# Altium schematic sheet Sheet1.SchDoc
size A4
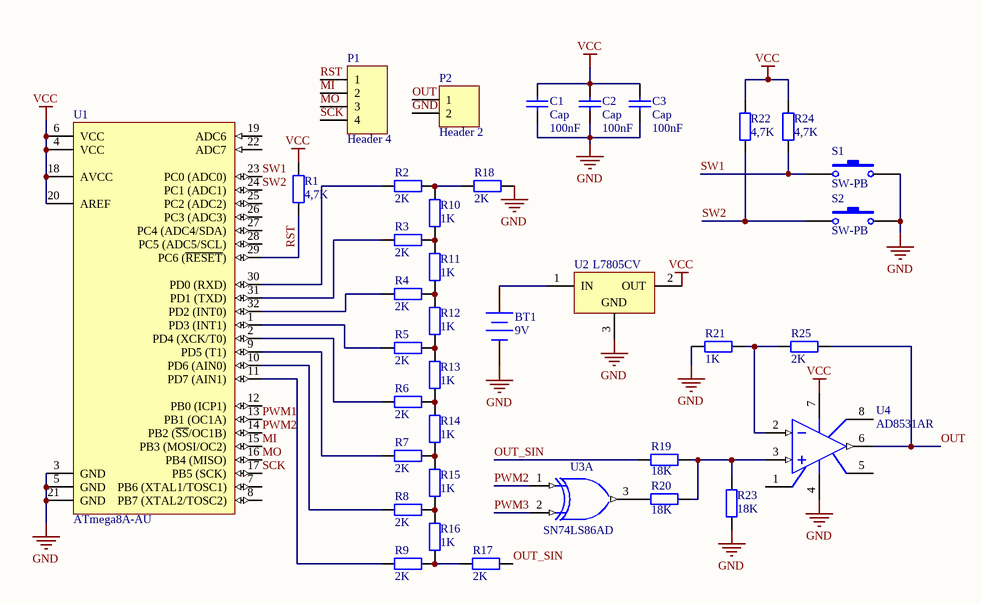
[diagram p0: Sheet1.SchDoc]

## Parts
BT1  9V  [BAT-2]
C1  Cap  value 100nF  [RAD-0.3]
C2  Cap  value 100nF  [RAD-0.3]
C3  Cap  value 100nF  [RAD-0.3]
P1  Header 4  [HDR1X4]
P2  Header 2  [HDR1X2]
R1  value 4,7K  [AXIAL-0.4]  (hidden comment: Res2)
R2  value 2K  [AXIAL-0.4]  (hidden comment: Res2)
R3  value 2K  [AXIAL-0.4]  (hidden comment: Res2)
R4  value 2K  [AXIAL-0.4]  (hidden comment: Res2)
R5  value 2K  [AXIAL-0.4]  (hidden comment: Res2)
R6  value 2K  [AXIAL-0.4]  (hidden comment: Res2)
R7  value 2K  [AXIAL-0.4]  (hidden comment: Res2)
R8  value 2K  [AXIAL-0.4]  (hidden comment: Res2)
R9  value 2K  [AXIAL-0.4]  (hidden comment: Res2)
R10  value 1K  [AXIAL-0.4]  (hidden comment: Res2)
R11  value 1K  [AXIAL-0.4]  (hidden comment: Res2)
R12  value 1K  [AXIAL-0.4]  (hidden comment: Res2)
R13  value 1K  [AXIAL-0.4]  (hidden comment: Res2)
R14  value 1K  [AXIAL-0.4]  (hidden comment: Res2)
R15  value 1K  [AXIAL-0.4]  (hidden comment: Res2)
R16  value 1K  [AXIAL-0.4]  (hidden comment: Res2)
R17  value 2K  [AXIAL-0.4]  (hidden comment: Res2)
R18  value 2K  [AXIAL-0.4]  (hidden comment: Res2)
R19  value 18K  [AXIAL-0.4]  (hidden comment: Res2)
R20  value 18K  [AXIAL-0.4]  (hidden comment: Res2)
R21  value 1K  [AXIAL-0.4]  (hidden comment: Res2)
R22  value 4,7K  [AXIAL-0.4]  (hidden comment: Res2)
R23  value 18K  [AXIAL-0.4]  (hidden comment: Res2)
R24  value 4,7K  [AXIAL-0.4]  (hidden comment: Res2)
R25  value 2K  [AXIAL-0.4]  (hidden comment: Res2)
S1  SW-PB  [SPST-2]
S2  SW-PB  [SPST-2]
U1  ATmega8A-AU  [32A_N]
U2  L7805CV  [TO220ABN]
U3  SN74LS86AD  [D014_N]  (part A of 4)
U4  AD8531AR  [SO-8_N]

## Nets
GND: BT1.2(-) C1.1 C2.1 C3.1 P2.2 R18.2 R21.1 R23.2 S1.2 S2.2 U1.3(GND) U1.5(GND) U1.21(GND) U2.3(GND) U3.7(GND) U4.4(V-)
VCC: C1.2 C2.2 C3.2 R1.2 R22.2 R24.2 U1.4(VCC) U1.6(VCC) U1.18(AVCC) U1.20(AREF) U2.2(OUT) U3.14(VCC) U4.7(V+)
MI: P1.2 U1.15(PB3_(MOSI/OC2))
MO: P1.3 U1.16(PB4_(MISO))
OUT: P2.1 R25.2 U4.6(OUT)
OUT_SIN: R17.2 R19.1
PWM1: U1.13(PB1_(OC1A))
PWM2: U1.14(PB2_(~{SS}/OC1B)) U3.1(A)
PWM3: U3.2(B)
RST: P1.1 R1.1 U1.29(PC6_(~{RESET}))
SCK: P1.4 U1.17(PB5_(SCK))
SW1: R24.1 S1.1 U1.23(PC0_(ADC0))
SW2: R22.1 S2.1 U1.24(PC1_(ADC1))
NetBT1_1: BT1.1(+) U2.1(IN)
NetR2_1: R2.1 U1.30(PD0_(RXD))
NetR2_2: R2.2 R10.2 R18.1
NetR3_1: R3.1 U1.31(PD1_(TXD))
NetR3_2: R3.2 R10.1 R11.2
NetR4_1: R4.1 U1.32(PD2_(INT0))
NetR4_2: R4.2 R11.1 R12.2
NetR5_1: R5.1 U1.1(PD3_(INT1))
NetR5_2: R5.2 R12.1 R13.2
NetR6_1: R6.1 U1.2(PD4_(XCK/T0))
NetR6_2: R6.2 R13.1 R14.2
NetR7_1: R7.1 U1.9(PD5_(T1))
NetR7_2: R7.2 R14.1 R15.2
NetR8_1: R8.1 U1.10(PD6_(AIN0))
NetR8_2: R8.2 R15.1 R16.2
NetR9_1: R9.1 U1.11(PD7_(AIN1))
NetR9_2: R9.2 R16.1 R17.1
NetR19_2: R19.2 R20.2 R23.1 U4.3(IN+)
NetR20_1: R20.1 U3.3(Y)
NetR21_2: R21.2 R25.1 U4.2(IN-)

Not connected (* = marked no-connect by the designer): U1 7(PB6_(XTAL1/TOSC1)) 8(PB7_(XTAL2/TOSC2)) 12(PB0_(ICP1)) 19(ADC6) 22(ADC7) 25(PC2_(ADC2)) 26(PC3_(ADC3)) 27(PC4_(ADC4/SDA)) 28(PC5_(ADC5/SCL)); U4 1(OS_NULL) 5(OS_NULL) 8(NC)

## Library data of the parts
BT1 = Battery: Multicell Battery; Published: 24-Mar-1999; LatestRevisionDate: 17-Jul-2002; LatestRevisionNote: Re-released for DXP Platform.; PackageReference: BAT-2; Publisher: Altium Limited; PackageDescription: Battery; 2 Leads
C1-C3 = Cap: Capacitor; Published: 8-Jun-2000; LatestRevisionDate: 17-Jul-2002; LatestRevisionNote: Re-released for DXP Platform.; PackageReference: RAD-0.3; Publisher: Altium Limited; PackageDescription: Radial Cap, Thru-Hole; 2 Leads; 0.3 in Pin Spacing
P1 = Header 4: Header, 4-Pin; LatestRevisionDate: 17-Jul-2002; LatestRevisionNote: Re-released for DXP Platform.; Publisher: Altium Limited
P2 = Header 2: Header, 2-Pin; LatestRevisionDate: 17-Jul-2002; LatestRevisionNote: Re-released for DXP Platform.; Publisher: Altium Limited
R1-R25 = Res2: Resistor; Published: 8-Jun-2000; LatestRevisionDate: 17-Jul-2002; LatestRevisionNote: Re-released for DXP Platform.; PackageReference: AXIAL-0.4; Publisher: Altium Limited; PackageDescription: Axial Device, Thru-Hole; 2 Leads; 0.4 in Pin Spacing
S1 S2 = SW-PB: Switch; Published: 24-Mar-1999; LatestRevisionDate: 17-Jul-2002; LatestRevisionNote: Re-released for DXP Platform.; PackageReference: SPST-2; Publisher: Altium Limited; PackageDescription: Switch; 2 Leads
U1 = ATmega8A-AU: 8-bit AVR Microcontroller, 8KB Flash, 512 Bytes EEPROM, 1KB SRAM, 32-pin TQFP, Industrial Grade (-40°C to 85°C); Published: 1-Apr-2010; DatasheetVersion: revC, Jul-2009; PackageVersion: revB, Oct-2001; PackageReference: 32A; Publisher: Altium Limited; PackageDescription: 32-Lead, 7x7x1.0 mm Body, 0.8mm Lead Pitch, Thin Profile Plastic Quad Flat Package (TQFP); Supplier 1: Digi-Key; Supplier Part Number 1: ATMEGA8A-AU-ND; Supplier 2: Farnell; Supplier Part Number 2: 1748532; Supplier 3: Mouser; Supplier Part Number 3: 556-ATMEGA8A-AU; Code_JEDEC: MS-026-ABA; ComponentLink1Description: Manufacturer Link; ComponentLink1URL: http://www.atmel.com/products/avr/default.asp?; ComponentLink2Description: ATmega8A Datasheet; ComponentLink2URL: http://www.atmel.com/dyn/resources/prod_documents/doc8159.pdf; ComponentLink3Description: ATmega8A Summary; ComponentLink3URL: http://www.atmel.com/dyn/resources/prod_documents/8159S.pdf; ComponentLink4Description: Atmel.com Home; ComponentLink4URL: http://www.atmel.com
U2 = L7805CV: Positive Voltage Regulator; Note: Tab is connected to pin 3 (GND).; Published: 24-Aug-2001; LatestRevisionDate: 17-Jul-2002; LatestRevisionNote: Re-released for DXP Platform.; DatasheetVersion: Dec-1998; PackageVersion: Jun-1998; PackageReference: TO220ABN; Publisher: Altium Limited; PackageDescription: TO, Thru-Hole, Vertical, Heatsink Mounted; 3 In-Line Leads; Pitch 2.54 mm; Pin sequence 1, 3, 2; ComponentLink1Description: Manufacturer Link; ComponentLink1URL: http://www.st.com/
U3 = SN74LS86AD: Quadruple 2-Input Exclusive-OR Gate; Published: 8-Jun-2000; LatestRevisionDate: 13-Apr-2006; LatestRevisionNote: IPC-7351 Footprint Added.; DatasheetVersion: Mar-1988; PackageVersion: Jan-1998; PackageReference: D014; Publisher: Altium Limited; PackageDescription: 14-Pin Small Outline Integrated Circuit 1.27 mm Pitch; Code_IPC: SOIC127P600-14; ComponentLink1Description: Manufacturer Link; ComponentLink1URL: http://www.ti.com/; ComponentLink2Description: Datasheet; ComponentLink2URL: http://www-s.ti.com/sc/ds/sn74ls86a.pdf
U4 = AD8531AR: Low Cost, 250 mA Output Single-Supply Amplifier; Note: Pin 8 is not connected.; Published: 8-Jun-2000; LatestRevisionDate: 13-Apr-2006; LatestRevisionNote: IPC-7351 Footprint Added.; DatasheetVersion: REV. A 1997; PackageVersion: revA; PackageReference: SO-8; Publisher: Altium Limited; PackageDescription: 8-Pin Small Outline Integrated Circuit 1.27 mm Pitch; Code_JEDEC: MS-012-AA; Code_IPC: SOIC127P600-8; ComponentLink1Description: Manufacturer Link; ComponentLink1URL: http://www.analog.com/en/prod/0,,759_786_AD8531%2C00.html; ComponentLink2Description: Datasheet; ComponentLink2URL: http://www.analog.com/UploadedFiles/Data_Sheets/93565307AD8531_2_4_E.pdf